# EAGLE design Board_I (EAGLE 9.3.0)
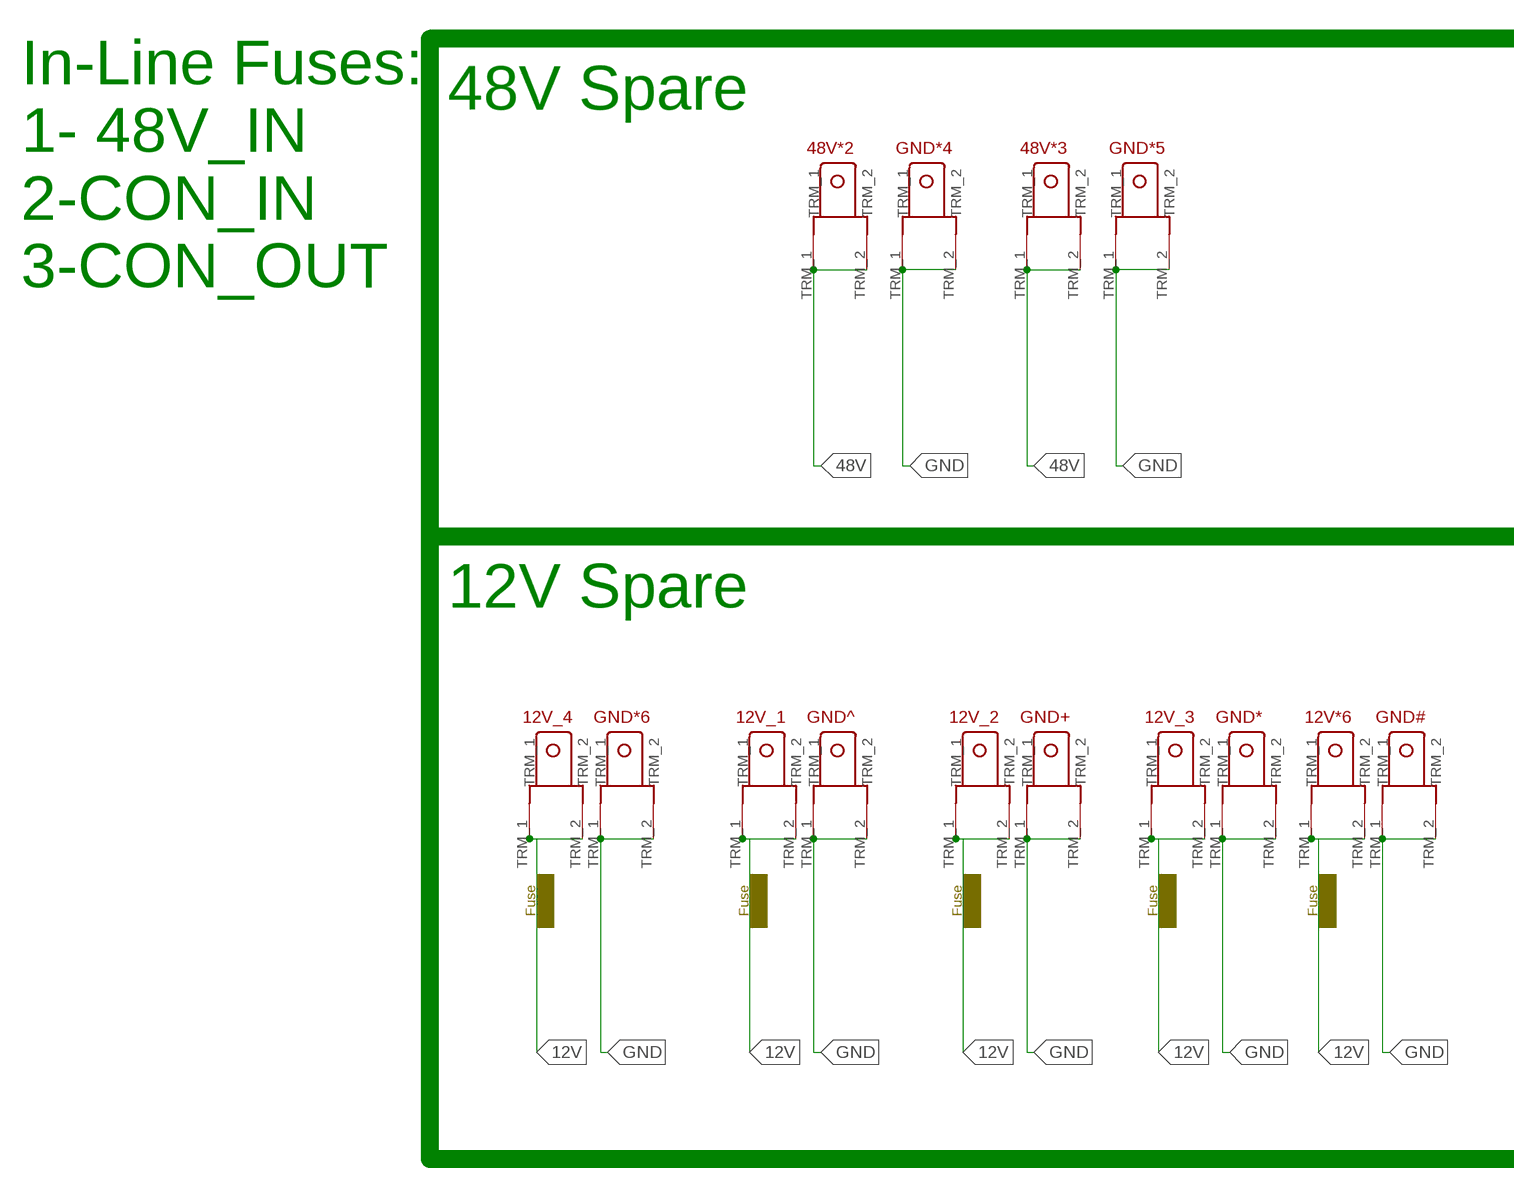
[diagram p0: schematic, sheet 1, part 1 of 2]
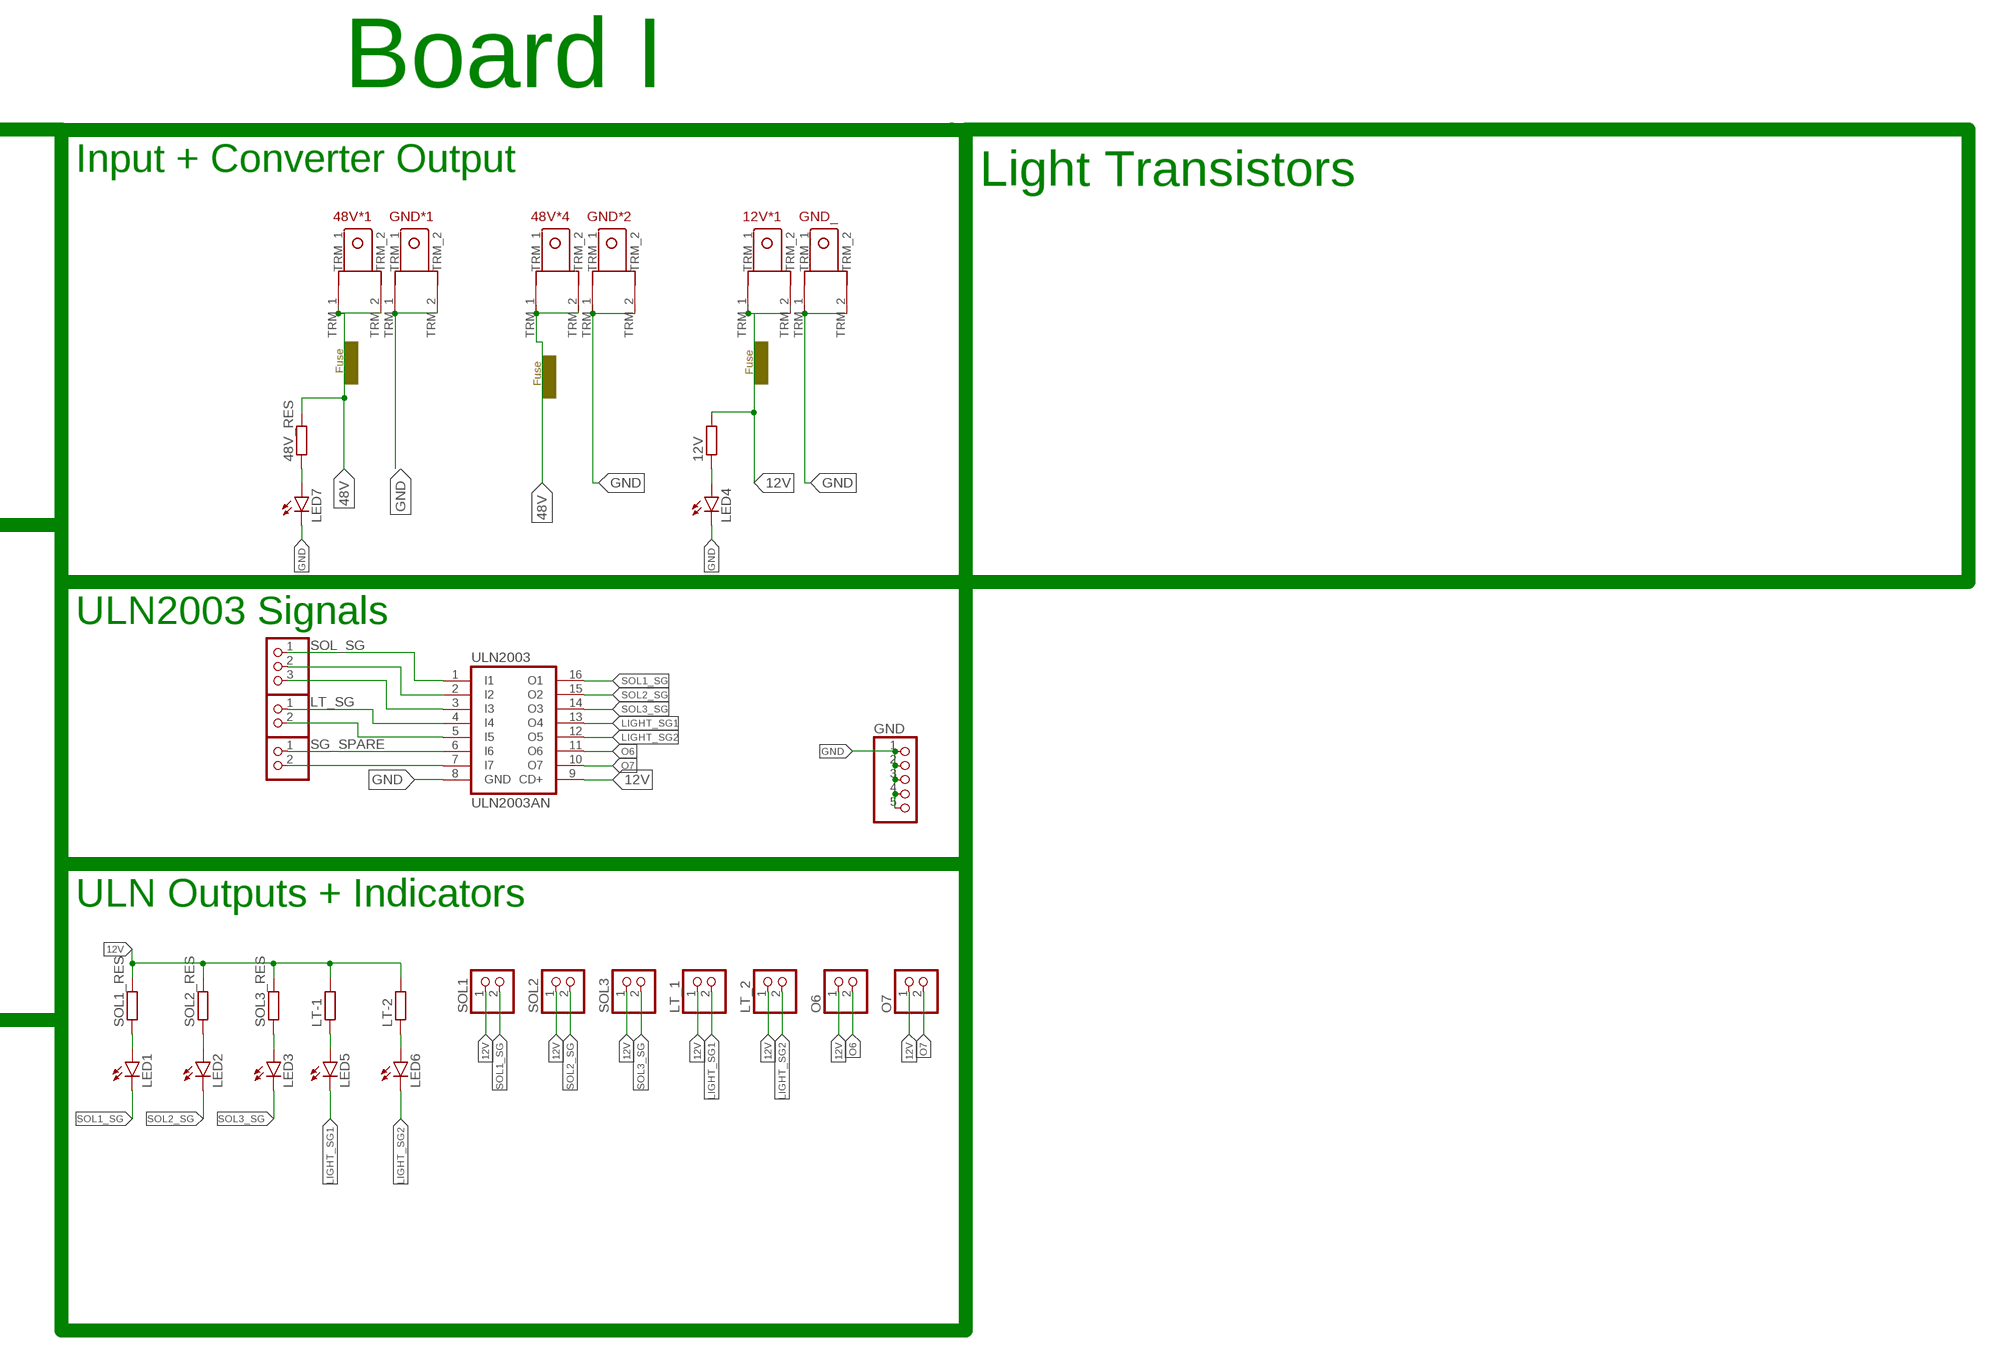
[diagram p1: schematic, sheet 1, part 2 of 2]

## Parts
12V  RESISTOR  [0207/10]
12V*1  TERMINAL_EDITED  [TERMINAL_EDITED]
12V*6  TERMINAL_EDITED  [TERMINAL_EDITED]
12V_1  TERMINAL_EDITED  [TERMINAL_EDITED]
12V_2  TERMINAL_EDITED  [TERMINAL_EDITED]
12V_3  TERMINAL_EDITED  [TERMINAL_EDITED]
12V_4  TERMINAL_EDITED  [TERMINAL_EDITED]
48V*1  TERMINAL_EDITED  [TERMINAL_EDITED]
48V*2  TERMINAL_EDITED  [TERMINAL_EDITED]
48V*3  TERMINAL_EDITED  [TERMINAL_EDITED]
48V*4  TERMINAL_EDITED  [TERMINAL_EDITED]
48V_RES  RESISTOR  [0207/10]
GND  PINHD-1X5  [1X05]
GND#  TERMINAL_EDITED  [TERMINAL_EDITED]
GND*  TERMINAL_EDITED  [TERMINAL_EDITED]
GND*1  TERMINAL_EDITED  [TERMINAL_EDITED]
GND*2  TERMINAL_EDITED  [TERMINAL_EDITED]
GND*4  TERMINAL_EDITED  [TERMINAL_EDITED]
GND*5  TERMINAL_EDITED  [TERMINAL_EDITED]
GND*6  TERMINAL_EDITED  [TERMINAL_EDITED]
GND+  TERMINAL_EDITED  [TERMINAL_EDITED]
GND^  TERMINAL_EDITED  [TERMINAL_EDITED]
GND_  TERMINAL_EDITED  [TERMINAL_EDITED]
LED1  LED5MM  [LED5MM]
LED2  LED5MM  [LED5MM]
LED3  LED5MM  [LED5MM]
LED4  LED5MM  [LED5MM]
LED5  LED5MM  [LED5MM]
LED6  LED5MM  [LED5MM]
LED7  LED5MM  [LED5MM]
LT-1  RESISTOR  [0207/10]
LT-2  RESISTOR  [0207/10]
LT_1  PINHD-1X2  [1X02]
LT_2  PINHD-1X2  [1X02]
LT_SG  PINHD-1X2  [1X02]
O6  PINHD-1X2  [1X02]
O7  PINHD-1X2  [1X02]
SG_SPARE  PINHD-1X2  [1X02]
SOL1  PINHD-1X2  [1X02]
SOL1_RES  RESISTOR  [0207/10]
SOL2  PINHD-1X2  [1X02]
SOL2_RES  RESISTOR  [0207/10]
SOL3  PINHD-1X2  [1X02]
SOL3_RES  RESISTOR  [0207/10]
SOL_SG  PINHD-1X3  [1X03]
ULN2003  ULN2003AN  [DIL16]

## Nets
12V: 12V*1.TRM_1 12V*1.TRM_2 12V*6.TRM_1 12V*6.TRM_2 12V.2 12V_1.TRM_1 12V_1.TRM_2 12V_2.TRM_1 12V_2.TRM_2 12V_3.TRM_1 12V_3.TRM_2 12V_4.TRM_1 12V_4.TRM_2 LT-1.2 LT-2.2 LT_1.1 LT_2.1 O6.1 O7.1 SOL1.1 SOL1_RES.2 SOL2.1 SOL2_RES.2 SOL3.1 SOL3_RES.2 ULN2003.9(CD+)
48V: 48V*1.TRM_1 48V*1.TRM_2 48V*2.TRM_1 48V*2.TRM_2 48V*3.TRM_1 48V*3.TRM_2 48V*4.TRM_1 48V*4.TRM_2 48V_RES.2
GND: GND#.TRM_1 GND#.TRM_2 GND*1.TRM_1 GND*1.TRM_2 GND*2.TRM_1 GND*2.TRM_2 GND*4.TRM_1 GND*4.TRM_2 GND*5.TRM_1 GND*5.TRM_2 GND*6.TRM_1 GND*6.TRM_2 GND*.TRM_1 GND*.TRM_2 GND+.TRM_1 GND+.TRM_2 GND.1 GND.2 GND.3 GND.4 GND.5 GND^.TRM_1 GND^.TRM_2 GND_.TRM_1 GND_.TRM_2 LED4.K(C) LED7.K(C) ULN2003.8(GND)
LIGHT_SG1: LED5.K(C) LT_1.2 ULN2003.13(O4)
LIGHT_SG2: LED6.K(C) LT_2.2 ULN2003.12(O5)
N$1: LED6.A LT-2.1
N$2: SOL_SG.1 ULN2003.1(I1)
N$4: 48V_RES.1 LED7.A
N$7: SOL_SG.2 ULN2003.2(I2)
N$8: 12V.1 LED4.A
N$9: SOL_SG.3 ULN2003.3(I3)
N$10: LED1.A SOL1_RES.1
N$11: LED2.A SOL2_RES.1
N$12: LED3.A SOL3_RES.1
N$13: LT_SG.1 ULN2003.4(I4)
N$14: LT_SG.2 ULN2003.5(I5)
N$15: SG_SPARE.1 ULN2003.6(I6)
N$16: SG_SPARE.2 ULN2003.7(I7)
N$20: LED5.A LT-1.1
O6: O6.2 ULN2003.11(O6)
O7: O7.2 ULN2003.10(O7)
SOL1_SG: LED1.K(C) SOL1.2 ULN2003.16(O1)
SOL2_SG: LED2.K(C) SOL2.2 ULN2003.15(O2)
SOL3_SG: LED3.K(C) SOL3.2 ULN2003.14(O3)

## Notes on the sheet
- Board I
- Input + Converter Output
- 48V Spare | Light Transistors
- In-Line Fuses:
  1- 48V_IN
  2-CON_IN
  3-CON_OUT
- Fuse | Fuse
- Fuse
- 12V Spare
- ULN2003 Signals
- Fuse | Fuse | Fuse | Fuse | Fuse
- ULN Outputs + Indicators

## Library data of the parts
12V 48V_RES LT-1 LT-2 SOL1_RES SOL2_RES SOL3_RES = 1-ROV Components:RESISTOR
12V*1 12V*6 12V_1-12V_4 48V*1-48V*4 GND# GND* GND*1 GND*2 GND*4-GND*6 GND+ GND^ GND_ = 1-ROV Components:TERMINAL_EDITED
GND = pinhead:PINHD-1X5: PIN HEADER
LED1-LED7 = led:LED: LED OSRAM: - CHIPLED LG R971, LG N971, LY N971, LG Q971, LY Q971, LO R971, LY R971 LH N974, LH R974 LS Q976, LO Q976, LY Q976 LO Q996 - Hyper CHIPLED LW Q18S LB Q993, LB Q99A, LB R99A - SideLED LS A670, LO A670, LY A670, LG A670, LP A670 LB A673, LV A673, LT A673, LW A673 LH A674 LY A675 LS A676, LA A676, LO A676, LY A676, LW A676 LS A679, LY A679, LG A679 - Hyper Micro SIDELED® LS Y876, LA Y876, LO Y876, LY Y876 LT Y87S - SmartLED LW L88C, LW L88S LB L89C, LB L89S, LG L890 LS L89K, LO L89K, LY L89K LS L896, LA L896, LO L896, LY L896 - TOPLED LS T670, LO T670, LY T670, LG T670, LP T670 LSG T670, LSP T670, LSY T670, LOP T670, LYG T670 LG T671, LOG T671, LSG T671 LB T673, LV T673, LT T673, LW T673 LH T674 LS T676, LA T676, LO T676, LY T676, LB T676, LH T676, LSB T676, LW T676 LB T67C, LV T67C, LT T67C, LS T67K, LO T67K, LY T67K, LW E67C LS E67B, LA E67B, LO E67B, LY E67B, LB E67C, LV E67C, LT E67C LW T67C LS T679, LY T679, LG T679 LS T770, LO T770, LY T770, LG T770, LP T770 LB T773, LV T773, LT T773, LW T773 LH T774 LS E675, LA E675, LY E675, LS T675 LS T776, LA T776, LO T776, LY T776, LB T776 LHGB T686 LT T68C, LB T68C - Hyper Mini TOPLED® LB M676 - Mini TOPLED Santana® LG M470 LS M47K, LO M47K, LY M47K Source: http://www.osram.convergy.de LUXEON: - LUMILED® LXK2-PW12-R00, LXK2-PW12-S00, LXK2-PW14-U00, LXK2-PW14-V00 LXK2-PM12-R00, LXK2-PM12-S00, LXK2-PM14-U00 LXK2-PE12-Q00, LXK2-PE12-R00, LXK2-PE12-S00, LXK2-PE14-T00, LXK2-PE14-U00 LXK2-PB12-K00, LXK2-PB12-L00, LXK2-PB12-M00, LXK2-PB14-N00, LXK2-PB14-P00, LXK2-PB14-Q00 LXK2-PR12-L00, LXK2-PR12-M00, LXK2-PR14-Q00, LXK2-PR14-R00 LXK2-PD12-Q00, LXK2-PD12-R00, LXK2-PD12-S00 LXK2-PH12-R00, LXK2-PH12-S00 LXK2-PL12-P00, LXK2-PL12-Q00, LXK2-PL12-R00 Source: www.luxeon.com KINGBRIGHT: KA-3528ASYC Source: www.kingbright.com
LT_1 LT_2 LT_SG O6 O7 SG_SPARE SOL1-SOL3 = pinhead:PINHD-1X2: PIN HEADER
SOL_SG = pinhead:PINHD-1X3: PIN HEADER
ULN2003 = uln-udn:ULN2003A: DRIVER ARRAY

## Board
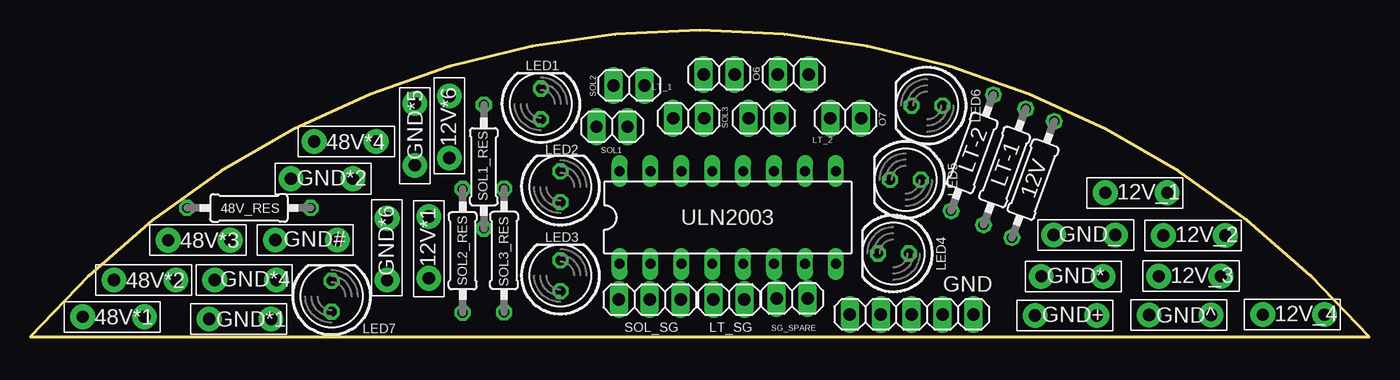
[diagram p2: board, top side]
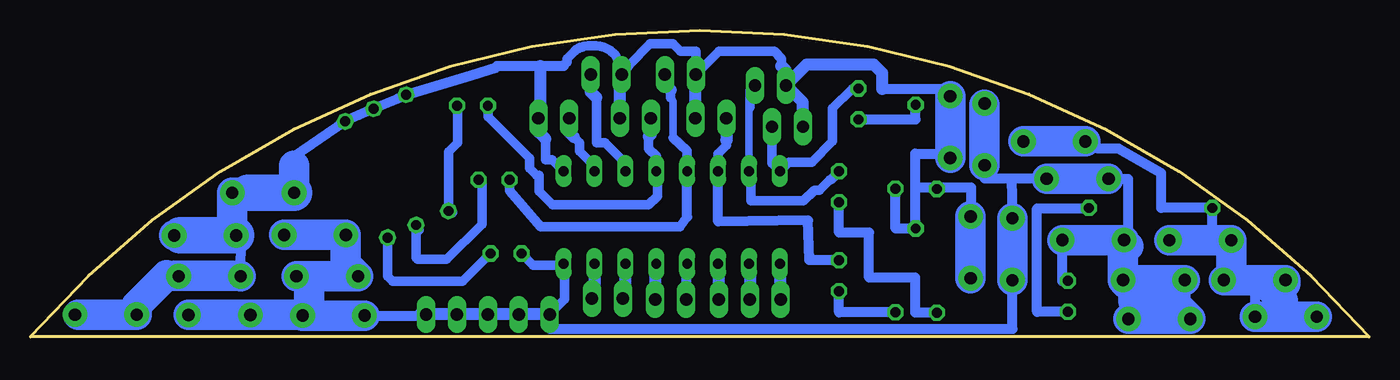
[diagram p3: board, bottom side, seen from below]

Size 110 x 25.17 mm. Coordinates in mm from the lower left corner, seen from the top.
Outline: 110,0 arc98 0,0 110,0
Copper layers (1*16): Top 0.035mm / dielectric 1.5mm / Bottom 0.035mm
Design rules "default *": minimum track width 6mil, minimum drill 0.35mm, track to track 0.8mm, track to pad 0.8mm, pad to pad 0.8mm, via to via 6mil, smd to smd 6mil, copper to edge 40mil, drill to drill 6mil, minimum pad ring 10mil, minimum via ring 8mil, stop-mask expansion 4mil, vias tented up to drill 0mil, thermal gap 10mil

### Footprints (pad centres in the part's own frame; a part is rotated, then mirrored left to right if it is on the bottom)
0207/10 = drill 0.813 octagon: 1 -5.08,0; 2 5.08,0
TERMINAL_EDITED = drill 1 pad 2.032: TRM_1 -2.54,0; TRM_2 2.54,0
1X05 = drill 1.016 long: 1 -5.08,0; 2 -2.54,0; 3 0,0; 4 2.54,0; 5 5.08,0
LED5MM = drill 0.813 octagon: A -1.27,0; K 1.27,0
1X02 = drill 1.016 long: 1 -1.27,0; 2 1.27,0
1X03 = drill 1.016 long: 1 -2.54,0; 2 0,0; 3 2.54,0
DIL16 = drill 0.813 long: 1 -8.89,-3.81; 2 -6.35,-3.81; 3 -3.81,-3.81; 4 -1.27,-3.81; 5 1.27,-3.81; 6 3.81,-3.81; 7 6.35,-3.81; 8 8.89,-3.81; 9 8.89,3.81; 10 6.35,3.81; 11 3.81,3.81; 12 1.27,3.81; 13 -1.27,3.81; 14 -3.81,3.81; 15 -6.35,3.81; 16 -8.89,3.81

### Placement (x,y rotation side)
12V  82.39,12.93 70 top
12V*1  32.74,7.35 90 top
12V*6  34.42,17.24 270 top
12V_1  90.87,11.83 0 top
12V_2  95.64,8.33 0 top
12V_3  95.27,4.99 180 top
12V_4  103.8,1.83 0 top
48V*1  6.83,1.65 0 top
48V*2  9.41,4.67 0 top
48V*3  13.87,7.95 0 top
48V*4  25.86,16.05 180 top
48V_RES  17.95,10.59 180 top
GND  72.41,1.85 0 top
GND#  22.67,7.95 0 top
GND*  85.6,4.97 180 top
GND*1  17.23,1.47 0 top
GND*2  23.95,12.99 180 top
GND*4  17.67,4.67 0 top
GND*5  31.59,16.63 90 top
GND*6  29.31,7.2 270 top
GND+  85.09,1.75 0 top
GND^  94.47,1.8 0 top
GND_  86.62,8.37 180 top
LED1  41.95,19.13 90 top
LED2  43.55,12.33 90 top
LED3  43.55,5.03 90 top
LED4  70.91,6.85 180 top
LED5  71.91,12.9 180 top
LED6  73.68,19 180 top
LED7  24.75,3.33 90 top
LT-1  80.05,13.96 70 top
LT-2  77.39,15.12 70 top
LT_1  56.59,21.56 0 top
LT_2  60.29,17.96 180 top
LT_SG  57.39,3.06 0 top
O6  62.69,21.56 0 top
O7  66.99,17.96 180 top
SG_SPARE  62.59,3.16 0 top
SOL1  47.79,17.26 0 top
SOL1_RES  37.26,13.98 270 top
SOL2  49.19,20.66 0 top
SOL2_RES  35.52,7.07 90 top
SOL3  54.09,17.96 180 top
SOL3_RES  38.92,7.1 90 top
SOL_SG  50.89,3.06 0 top
ULN2003  57.3,9.81 0 top

### Tracks (layer width: path | path; a pad name or v marks a point on that pad's centre or on a via)
12V
  Bottom 0.8: 55.36,21.52 LT_1.1 | LT_1.1 53.43,23.45 48.88,23.45 48.29,22.86 48.29,22.26 | LT_2.1 61.56,22.22 | 61.56,22.22 O6.1 60.79,22.36 59.09,24.06 57.19,24.06 56.59,23.46 55.29,23.46 55.29,21.59 LT_1.1 | ULN2003.9 67.13,14.56 67.69,14.56 67.69,16.26 | 66.19,22.36 66.19,22.26 65.89,22.56 65.89,22.86 65.29,23.46 arc37 64.49,23.86 arc16 63.19,23.86 arc74 61.56,22.22
  Bottom 0.813: 34.42,15.06 12V*6.TRM_1 34.42,20.36 39.99,20.36 | 106.09,1.83 12V_4.TRM_2 | 98.81,5.06 98.09,5.01 12V_3.TRM_1 12V_3.TRM_2 92.7,8.29 12V_2.TRM_1 93.41,8.33 | 93.41,8.33 97.69,8.33 | 93.41,8.33 12V_1.TRM_2 | 12V_1.TRM_1 88.09,11.83 88.09,12.06 | 88.32,14.06 88.32,14.83 12V.2 83.02,18.21 LT-1.2 79.8,19.58 LT-2.2 73.79,21.49 71.69,22.16 71.69,22.26 68.09,22.26 66.19,22.26 | SOL3_RES.2 38.92,8.9 SOL1_RES.2 37.29,11.7 37.29,12.26 | 37.29,12.26 37.29,15.06 34.42,15.06 | 34.42,15.06 12V*6.TRM_2 | 12V*1.TRM_2 32.69,9.89 32.69,12.26 35.42,12.26 | 35.42,12.26 SOL2_RES.2 | 35.42,12.26 37.29,12.26
  Bottom 1: SOL3.1 55.36,21.52 | LT_2.1 61.56,21.42 O6.1 | 68.09,22.26 68.09,18.13 O7.1 68.26,16.83 67.69,16.26 | 39.99,20.36 39.99,21.66 40.69,22.36 46.22,22.36 SOL2.1 | SOL1.1 46.52,19.26 SOL2.1 | SOL2.1 47.92,21.89 48.29,22.26
  Bottom 2.5: 92.09,11.83 12V_1.TRM_2 93.41,8.64 12V_2.TRM_1 | 97.69,8.33 12V_2.TRM_2 | 12V_3.TRM_2 92.75,5.01 98.09,5.01 | 98.81,5.06 101.26,2.61 12V_4.TRM_1 106.09,1.83 | 12V_1.TRM_1 88.32,14.06 | 12V*1.TRM_1 12V*1.TRM_2 | 12V*6.TRM_2 12V*6.TRM_1
  Bottom 3: 12V_1.TRM_1 92.09,11.83 | 12V_2.TRM_1 97.69,8.33
48V
  Bottom 0.813: 12.87,7.85 48V*3.TRM_1 11.33,7.56 | 48V*3.TRM_2 14.1,7.88 12.87,7.85 | 12.87,7.85 48V_RES.2 17.09,10.59 17.09,13.46 20.59,15.46 22.32,15.46 48V*4.TRM_2 | 48V*2.TRM_2 9.37,4.47 48V*1.TRM_2
  Bottom 2.5: 48V*1.TRM_2 7.09,1.65 | 7.09,1.65 48V*1.TRM_1 | 7.09,1.65 7.09,2.96 8.49,4.36 6.88,4.36 48V*2.TRM_1 48V*2.TRM_2 11.33,4.99 11.33,7.56 | 48V*3.TRM_1 48V*3.TRM_2 | 48V*4.TRM_2 48V*4.TRM_1
GND
  Bottom 0.8: GND.1 66.09,3.09 66.09,5.9 | 66.09,5.9 ULN2003.8 | LED4.K 68.69,5.9 66.09,5.9
  Bottom 0.813: GND.4 GND.5 77.49,1.75 78.09,1.75 GND+.TRM_1 | GND*1.TRM_1 14.93,1.47 GND*4.TRM_1 | LED7.K 25.21,4.6 GND#.TRM_2 | 29.41,12.99 GND*6.TRM_1 | GND*2.TRM_1 29.41,12.99 | 29.41,12.99 31.59,12.99 GND*5.TRM_1 | 31.59,19.06 GND*5.TRM_2 | GND^.TRM_2 GND^.TRM_1 92.73,1.85 92.09,1.84 GND+.TRM_2 | GND*6.TRM_2 29.31,0.66 67.09,0.66 67.29,0.65 GND.1 69.54,1.85 | GND*2.TRM_2 21.41,12.96 19.79,12.96 19.79,7.45 19.71,7.95 GND#.TRM_1 20.13,4.57 GND*4.TRM_2 | GND*.TRM_2 84.08,4.97 84.08,8.06 GND_.TRM_2
  Bottom 1: GND.1 GND.2 GND.3 GND.4 77.99,1.85 78.09,1.75
  Bottom 2.5: GND+.TRM_1 GND+.TRM_2 | 87.09,4.97 GND*.TRM_2 84.08,5.99 84.08,8.06 | 87.09,4.97 GND*.TRM_1 | GND+.TRM_2 87.09,2.29 87.09,4.97 | GND_.TRM_2 GND_.TRM_1 | GND^.TRM_2 92.13,1.8 92.09,1.84 | GND^.TRM_1 87.68,1.8 GND+.TRM_2 | GND*1.TRM_2 14.93,1.47 | GND*1.TRM_1 16.18,2.96 19.39,2.96 19.39,3.85 GND*4.TRM_2 | GND*4.TRM_2 GND*4.TRM_1 | GND*4.TRM_2 20.21,7.63 19.79,7.45 | GND#.TRM_1 GND#.TRM_2 | GND*2.TRM_2 GND*2.TRM_1 | GND*6.TRM_2 GND*6.TRM_1 | GND*5.TRM_1 31.59,19.06
LIGHT_SG1
  Bottom 0.61: 57.19,16.36 57.19,19.36 57.39,19.66
  Bottom 0.8: ULN2003.13 56.03,15.3 57.19,16.36 | 57.39,20.26 57.39,19.66 | LED5.K 70.64,12.01 68.09,9.06 56.63,9.06 56.03,9.86
  Bottom 0.813: 56.19,13.62 ULN2003.13 56.03,9.86
  Bottom 1: LT_1.2 57.86,20.73 57.39,20.26
LIGHT_SG2
  Bottom 0.8: 59.19,16.46 59.19,15.46 58.57,14.84 ULN2003.12 58.49,13.54 58.49,11.56 59.19,10.86 67.09,10.86 68.19,11.96 68.19,13.26 68.39,13.26 68.99,13.86 68.99,14.66 72.41,18.08 LED6.K
  Bottom 0.813: ULN2003.12 58.69,13.62
  Bottom 1: LT_2.2 59.02,16.63 59.19,16.46
N$1
  Bottom 0.8: LT-2.1 75.65,15.2 74.89,15.96 74.89,18.94 LED6.A
  Bottom 0.813: 75.33,10.22 LT-2.1
N$2
  Bottom 0.813: 48.35,6 ULN2003.1
  Bottom 1: SOL_SG.1 48.35,6
N$4
  Bottom 0.813: LED7.A 27.29,2.06 27.29,10.56 23.13,10.56 48V_RES.1
N$7
  Bottom 1: ULN2003.2 50.89,5.94 SOL_SG.2
N$8
  Bottom 0.8: LED4.A 74.47,4.56 80.26,4.56 80.66,4.96 12V.1
N$9
  Bottom 0.813: 53.43,6 ULN2003.3
  Bottom 1: SOL_SG.3 53.43,6
N$10
  Bottom 0.813: LED1.A 37.26,17.86 SOL1_RES.1
N$11
  Bottom 0.813: SOL2_RES.1 37.29,1.99 37.29,4.86 41.09,4.86 41.09,8.56 43.55,8.56 LED2.A
N$12
  Bottom 0.813: SOL3_RES.1 43.55,2.02 LED3.A
N$13
  Bottom 0.813: ULN2003.4 56.12,6 LT_SG.1
N$14
  Bottom 1: ULN2003.5 58.66,5.91 LT_SG.2
N$15
  Bottom 1: SG_SPARE.1 61.11,3.37 ULN2003.6
N$16
  Bottom 1: ULN2003.7 63.65,3.37 SG_SPARE.2
N$20
  Bottom 0.8: LT-1.1 78.32,6.49 78.19,6.36 75.79,6.36 72.89,9.26 72.89,12.61 LED5.A
  Bottom 0.813: LT-1.1 78.09,8.79
O6
  Bottom 0.8: ULN2003.11 61.11,14.28 62.79,15.96 63.49,15.96 63.49,19.66
  Bottom 1: O6.2 63.96,20.13 63.49,19.66
O7
  Bottom 0.8: ULN2003.10 63.65,14.02 64.89,15.26 64.89,15.96 65.34,16.41
  Bottom 0.813: ULN2003.10 63.89,13.62
  Bottom 1: O7.2 65.72,16.79 65.34,16.41
SOL1_SG
  Bottom 0.8: SOL1.2 49.06,14.27 ULN2003.16 47.67,14.36 45.79,14.36 44.09,16.06 44.09,18.76 42.45,20.4 LED1.K
  Bottom 0.813: ULN2003.16 48.49,13.62
SOL2_SG
  Bottom 0.61: ULN2003.15 50.95,18.77 50.88,18.85
  Bottom 0.8: LED2.K 44.23,12.92 44.32,12.92 45.18,12.06 45.59,12.06 46.48,11.17 50.78,11.17 50.78,13.45 ULN2003.15 | 50.88,18.85 50.88,20.24 SOL2.2
  Bottom 0.813: ULN2003.15 50.89,13.62
SOL3_SG
  Bottom 0.8: ULN2003.14 53.49,15.06 52.79,15.76 52.79,16.16
  Bottom 0.813: LED3.K 45.99,6.3 46.09,9.56 53.49,9.46 ULN2003.14
  Bottom 1: SOL3.2 52.82,16.19 52.79,16.16